# EAGLE design PDR (EAGLE 9.2.2)
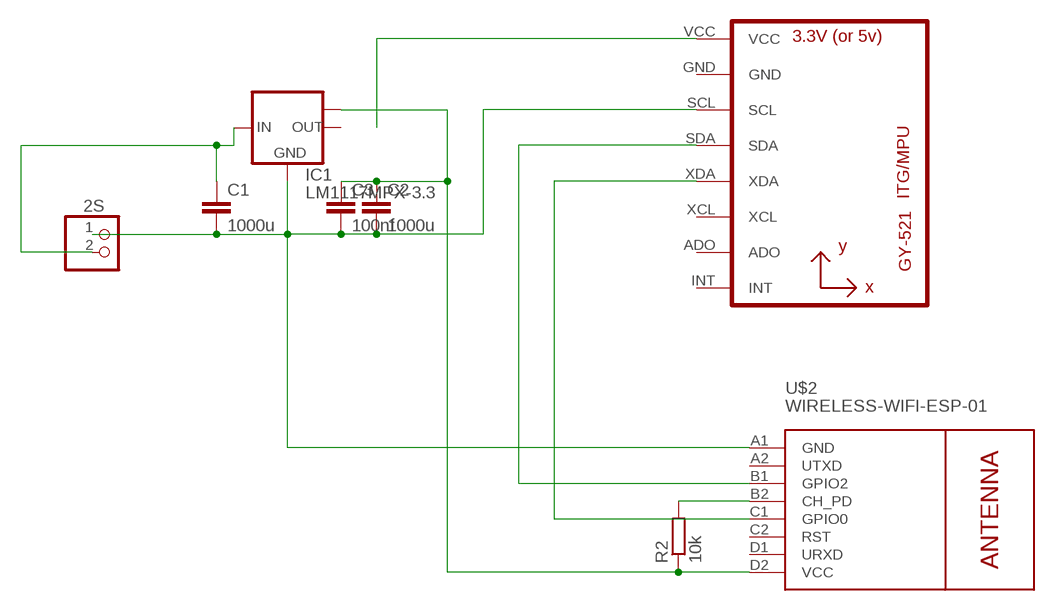
[diagram p0: schematic, sheet 1]

## Parts
2S  PINHD-1X2  [1X02]
C1  1000u  C2.5/2  [C2.5-2]
C2  1000u  C2.5/2  [C2.5-2]
C3  100nf  C2.5/2  [C2.5-2]
GY-91  GY-521MPU6050  [GY-521]
IC1  LM1117MPX-3.3  [SOT223]
R2  10k  R-EU_0204/7  [0204/7]
U$2  WIRELESS-WIFI-ESP-01  [WIRELESS-WIFI-ESP-01]

## Nets
N$1: 2S.1 C1.2 C2.2 C3.2 GY-91.SCL IC1.1(GND) U$2.A1(GND)
N$2: 2S.2 C1.1 IC1.3(IN)
N$3: C2.1 C3.1 IC1.TAB(OUT1) R2.1 U$2.D2(VCC)
N$6: GY-91.SDA U$2.B1(GPIO2)
N$7: GY-91.XDA U$2.C1(GPIO0)
N$9: GY-91.VCC
N$10: R2.2 U$2.B2(CH_PD)
Unconnected: GY-91.ADO GY-91.GND GY-91.INT GY-91.XCL IC1.2(OUT) U$2.A2(UTXD) U$2.C2(RST) U$2.D1(URXD)

## Library data of the parts
2S = pinhead:PINHD-1X2: PIN HEADER
C1-C3 = capacitor-wima:C: CAPACITOR naming: grid - package width
GY-91 = gy-521:GY-521
IC1 = lm1117:LM1117MPX-*
R2 = resistor:R-EU_: RESISTOR, European symbol
U$2 = esp8266modules:WIRELESS-WIFI-ESP-01: Wireless Wi-Fi ESP-01 Module based on ESP8266 chip Click here to find device on ebay.com <http://www.ebay.com/sch/esp8266+esp+01+transceiver>

## Net classes
0 default: width 0.61 mm

## Board
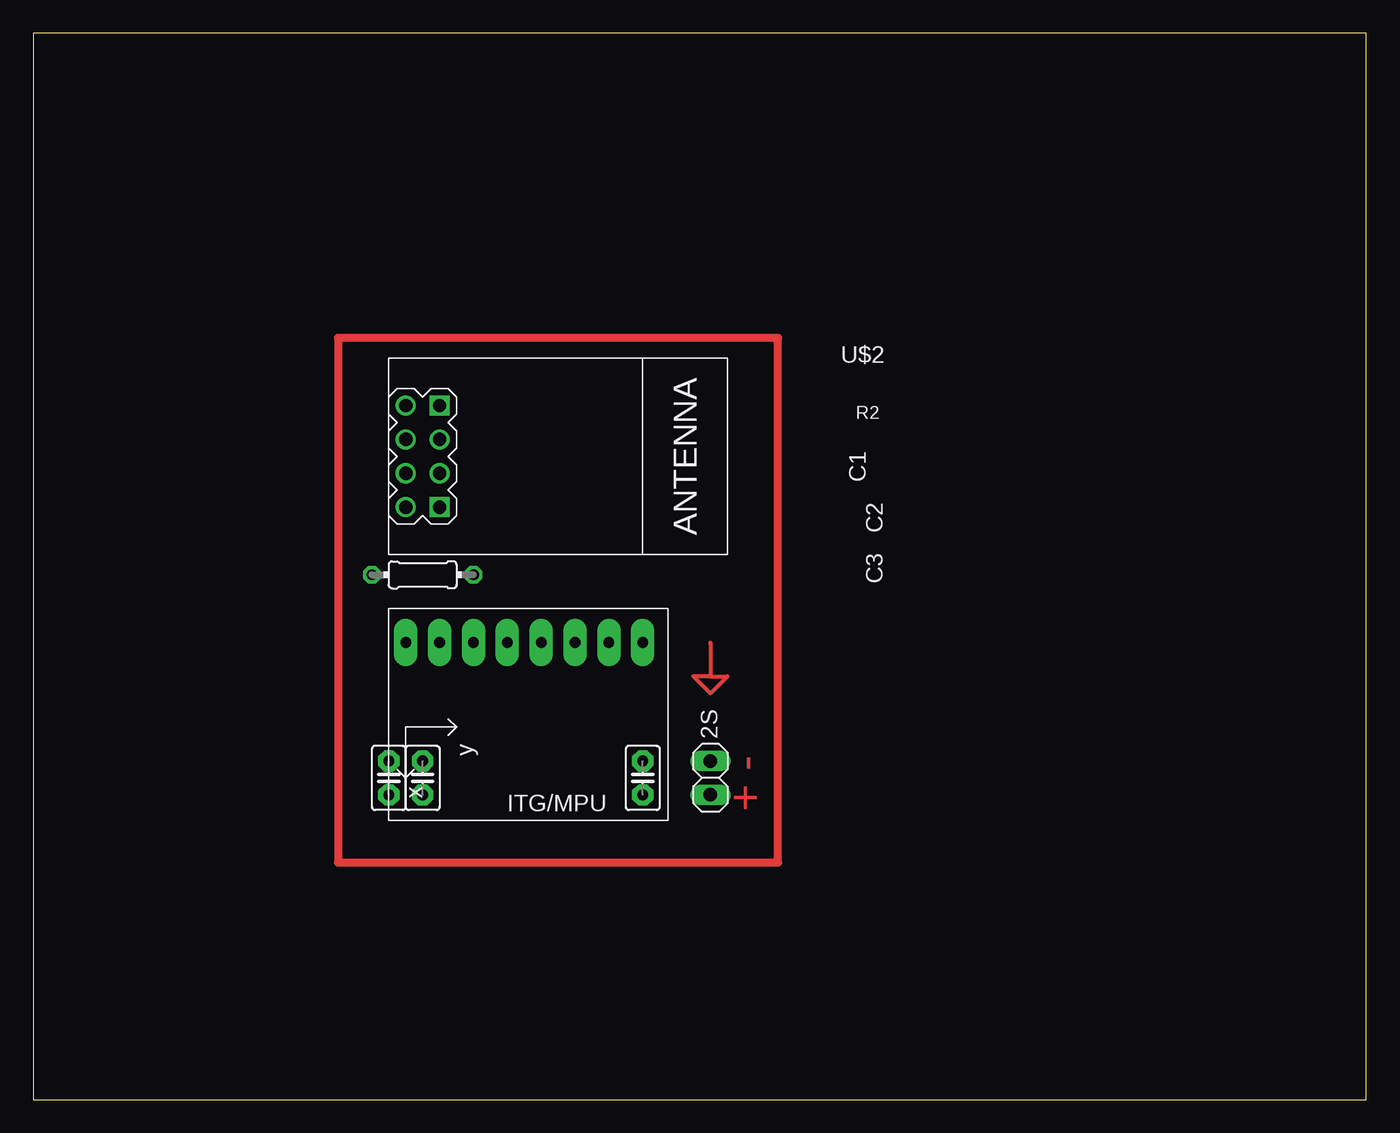
[diagram p1: board, top side]
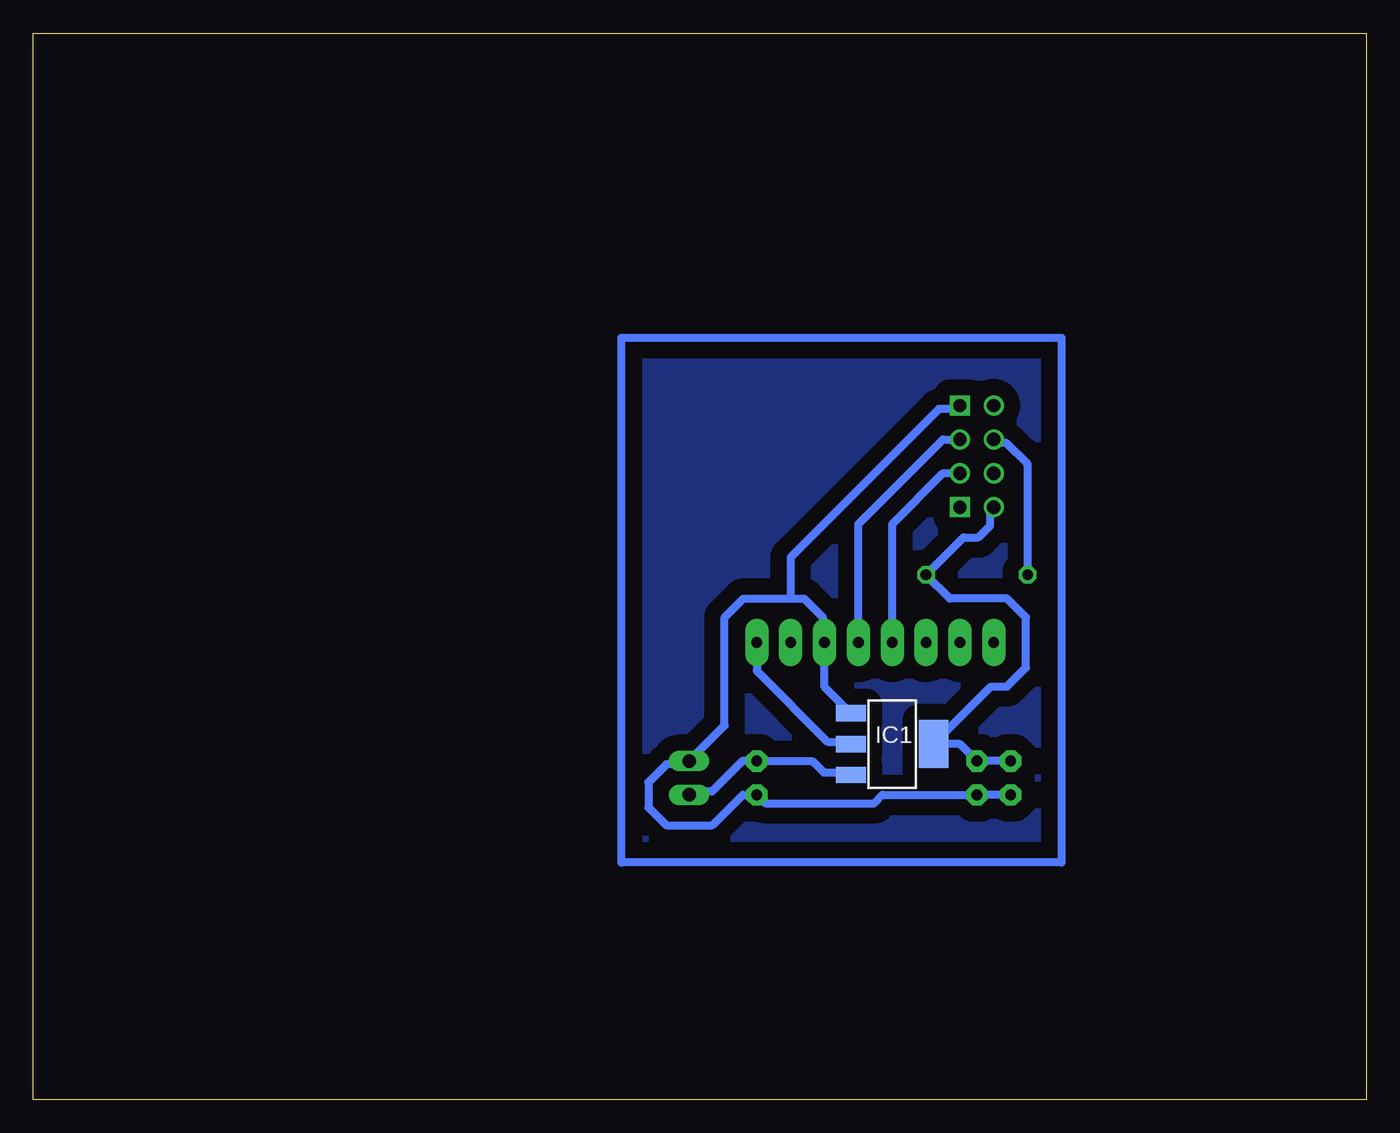
[diagram p2: board, bottom side, seen from below]

Size 100 x 80 mm. Coordinates in mm from the lower left corner, seen from the top.
Outline: 0,0 100,0 100,80 0,80 0,0
Copper layers (1*16): Top 0.035mm / dielectric 1.5mm / Bottom 0.035mm
Design rules "default *": minimum track width 6mil, minimum drill 0.35mm, track to track 48mil, track to pad 48mil, pad to pad 48mil, via to via 48mil, smd to smd 48mil, copper to edge 40mil, drill to drill 6mil, minimum pad ring 10mil, minimum via ring 8mil, stop-mask expansion 4mil, vias tented up to drill 0mil, thermal gap 10mil

### Footprints (pad centres in the part's own frame; a part is rotated, then mirrored left to right if it is on the bottom)
1X02 = drill 1.016 long: 1 -1.27,0; 2 1.27,0
C2.5-2 = drill 0.813 pad 1.6 octagon: 1 -1.27,0; 2 1.27,0
GY-521 = drill 0.8 pad 1.778 long: ADO -8.89,-6.35; GND -8.89,6.35; INT -8.89,-8.89; SCL -8.89,3.81; SDA -8.89,1.27; VCC -8.89,8.89; XCL -8.89,-3.81; XDA -8.89,-1.27
SOT223 = smd 1.219 x 2.235: 1 -2.311,-3.099; 2 0,-3.099; 3 2.311,-3.099 | smd 3.6 x 2.2: TAB 0,3.099
0204/7 = drill 0.813 octagon: 1 -3.81,0; 2 3.81,0
WIRELESS-WIFI-ESP-01 = drill 1 square: A1 -8.89,3.81; D1 -8.89,-3.81 | drill 1: A2 -11.43,3.81; B1 -8.89,1.27; B2 -11.43,1.27; C1 -8.89,-1.27; C2 -11.43,-1.27; D2 -11.43,-3.81

### Placement (x,y rotation side)
2S  50.8,24.13 270 top
C1  45.72,24.13 270 top
C2  29.21,24.13 270 top
C3  26.67,24.13 270 top
GY-91  36.83,25.4 270 top
IC1  35.56,26.67 270 bottom
R2  29.21,39.37 180 top
U$2  39.37,48.26 0 top

### Tracks (layer width: path | path; a pad name or v marks a point on that pad's centre or on a via)
N$1
  Bottom 0.61: IC1.1 40.64,30.96 GY-91.SCL 40.77,34.42 40.77,36.18 42.18,37.59 43.18,37.59 | 43.18,37.59 46.72,37.59 48.13,36.18 48.13,28.07 2S.1 51.05,25.15 52.51,25.15 53.85,23.81 53.85,21.91 52.51,20.57 49.05,20.57 46.76,22.86 C1.2 45.09,22.23 36.91,22.23 36.28,22.86 C2.2 C3.2 | U$2.A1 30.74,51.81 32.06,51.81 43.18,40.69 43.18,37.59
N$2
  Bottom 0.61: 2S.2 50.55,23.11 49.09,23.11 46.8,25.4 C1.1 | C1.1 45.5,25.18 | C1.1 41.55,25.4 40.68,24.54 38.84,24.54 IC1.3
N$3
  Bottom 0.61: U$2.D2 28.2,44.19 28.2,43.06 29.09,42.17 30.22,42.17 R2.1 31.24,37.59 26.94,37.59 25.53,36.18 25.53,32.4 26.94,30.99 28.14,30.99 IC1.TAB 30.48,26.67 C2.1 C3.1
N$4
  pour Bottom: 22.86,58.42 22.86,19.05 54.61,19.05 54.61,58.42
N$5
  Top 0.61: 22.86,57.15 22.86,17.78 55.88,17.78 55.88,57.15 22.86,57.15
N$6
  Bottom 0.61: GY-91.SDA 38.1,43.18 31.75,49.53 U$2.B1
N$7
  Bottom 0.61: GY-91.XDA 35.56,43.18 31.75,46.99 U$2.C1
N$8
  Top 0.305: 50.8,34.29 50.8,31.75 | 50.8,31.75 49.53,31.75 50.8,30.48 52.07,31.75 50.8,31.75
N$9
  Bottom 0.61: 38.84,26.85 40.41,26.85 45.72,32.16 GY-91.VCC
N$10
  Bottom 0.61: U$2.B2 27.68,49.27 27,49.27 25.4,47.67 R2.2
N$11
  Bottom 0.61: 22.86,57.15 22.86,17.78 55.88,17.78 55.88,57.15 22.86,57.15

### Text on the board
Top: + -